# Altium schematic sheet BATTERY.SchDoc
size A4; SheetNumber: 4; SheetTotal: 8
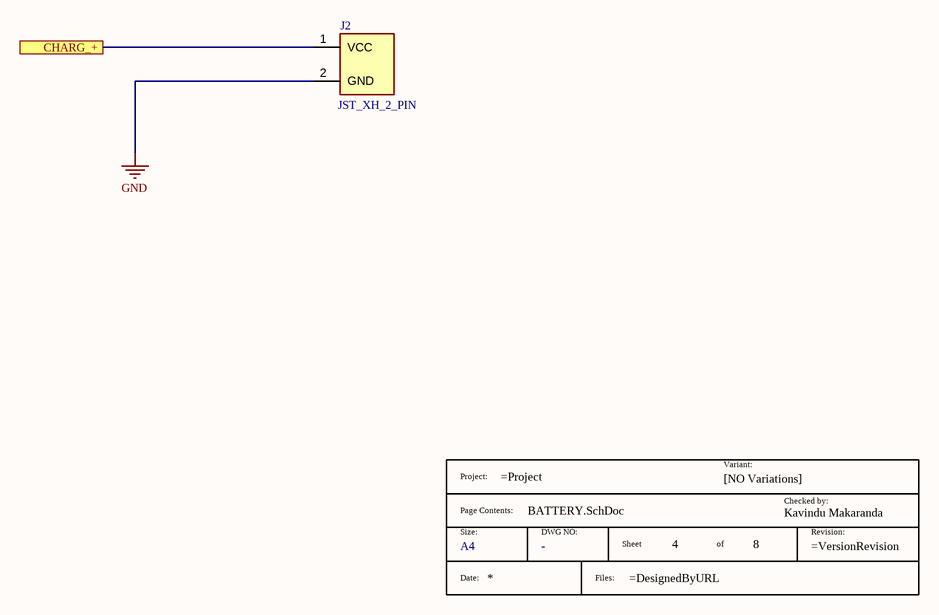
[diagram p0: BATTERY.SchDoc]

## Parts
*?  Size: A4  (hidden comment: TitleBlock)  (graphical)
J2  JST_XH_2_PIN  [B2BXHAGU]

## Ports
CHARG_+ (see Main_sch[3A], CHARGING IC[4B], FUEL GAUGE IC[4B])

## Nets
GND: J2.2(GND)
CHARG_+: J2.1(VCC) ; port CHARG_+

## Notes on the sheet
- THIS DOCUMENT AND THE DATA DISCLOSED HEREIN OR
- HEREWITH IS THE PROPERTY OF ALTIUM LIMITED AND MAY
- DWG NO:
- REVISION
- REV:
- DESCRIPTION
- DATE
- APPROVED
- BE FREELY DISTRIBUTED IN WHOLE. NO RIGHTS ARE
- RESERVED OR EXPRESS OR IMPLIED WARANTEE GIVEN.
- ENG:
- APPROVALS
- PROJECT
- DSN:
- CHK:
- REFERENCE DOCUMENTS
- PROJECT REVISION:
- TITLE
- DOCUMENT REVISION:
- DESIGN ITEM:
- BOM:
- FAB DWG:
- PCB DWG:
- ASSY DWG:
- SCALE:
- A3
- SIZE
- CAGE CODE
- FILE NAME
- DWG NO.
- SHEET
- OF
- REV
- (in symbol TitleBlock) Project:; Variant:; [NO Variations]; Checked by:; Page Contents:; Kavindu Makaranda; Size:; DWG NO:; Sheet; of; Revision:; Date:; Files:

## Library data of the parts
*? = TitleBlock: Standard Title Block; DWG NO: -
J2 = B2B-XH-A-GU: Connector; Manufacturer_Name: JST (JAPAN SOLDERLESS TERMINALS); Datasheet Link: http://www.jst-mfg.com/product/pdf/eng/eXH.pdf; Height: 7mm; Manufacturer_Part_Number: B2B-XH-A-GU; Mouser Part Number: N/A; Mouser Price/Stock: https://www.mouser.co.uk/ProductDetail/JST-Commercial/B2B-XH-A-GU?qs=IKkN%2F947nfBVsqimfO%252BieQ%3D%3D; Arrow Part Number: B2B-XH-A-GU; Arrow Price/Stock: https://www.arrow.com/en/products/b2b-xh-a-gu/jst-manufacturing?utm_currency=USD&region=europe